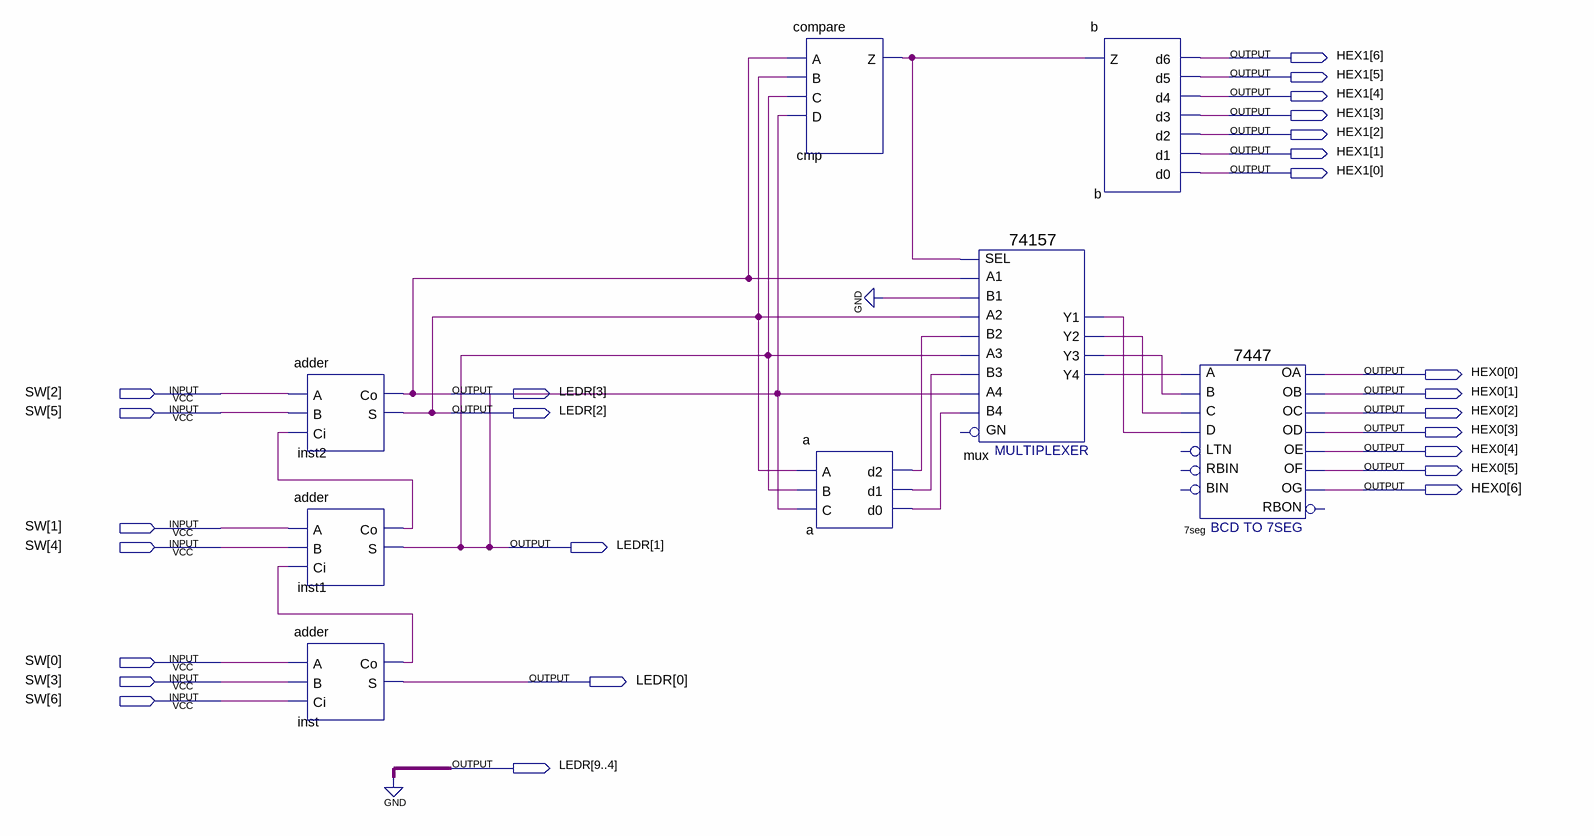
[diagram p0: schematic sheet]
// Quartus schematic part_c.bdf as structural Verilog: 8 symbols, 26 pins
module part_c (
  input  [6:0] SW,
  output [6:0] HEX1,
  output [6:0] HEX0,
  output [9:0] LEDR
);

  wire a_d0, a_d1, a_d2, cmp_z, inst1_co, inst_co, mux_y1, mux_y2, mux_y3, mux_y4;

  adder inst2 (.A(SW[2]), .B(SW[5]), .Ci(inst1_co), .Co(LEDR[3]), .S(LEDR[2]));
  adder inst1 (.A(SW[1]), .B(SW[4]), .Ci(inst_co), .Co(inst1_co), .S(LEDR[1]));
  adder inst (.A(SW[0]), .B(SW[3]), .Ci(SW[6]), .Co(inst_co), .S(LEDR[0]));
  compare cmp (.A(LEDR[3]), .B(LEDR[2]), .C(LEDR[1]), .D(LEDR[1]), .Z(cmp_z));
  a a (.A(LEDR[2]), .B(LEDR[1]), .C(LEDR[1]), .d2(a_d2), .d1(a_d1), .d0(a_d0));
  \74157  mux (
    .A1(LEDR[3]), .B1(1'b0), .SEL(cmp_z), .B2(a_d2), .A3(LEDR[1]), .B3(a_d1), .A2(LEDR[2]), .B4(a_d0),
    .A4(LEDR[1]), .Y2(mux_y2), .Y1(mux_y1), .Y4(mux_y4), .Y3(mux_y3));  // open: GN
  b b (.Z(cmp_z), .d6(HEX1[6]), .d5(HEX1[5]), .d4(HEX1[4]), .d3(HEX1[3]), .d2(HEX1[2]), .d1(HEX1[1]), .d0(HEX1[0]));
  \7447  u_7seg (
    .B(mux_y3), .C(mux_y2), .D(mux_y1), .A(mux_y4), .OB(HEX0[1]), .OC(HEX0[2]), .OE(HEX0[4]), .OD(HEX0[3]),
    .OF(HEX0[5]), .OG(HEX0[6]), .OA(HEX0[0]));  // open: LTN, RBIN, BIN, RBON

  assign LEDR[9:4] = {6{1'b0}};
endmodule
